# Altium schematic sheet Block scheme.SchDoc
size A4; Organization: My Company; Address1: Address Line 1; Address2: Address Line 2; Address3: Address Line 3; Address4: Address Line 4; SheetNumber: 1; SheetTotal: 8
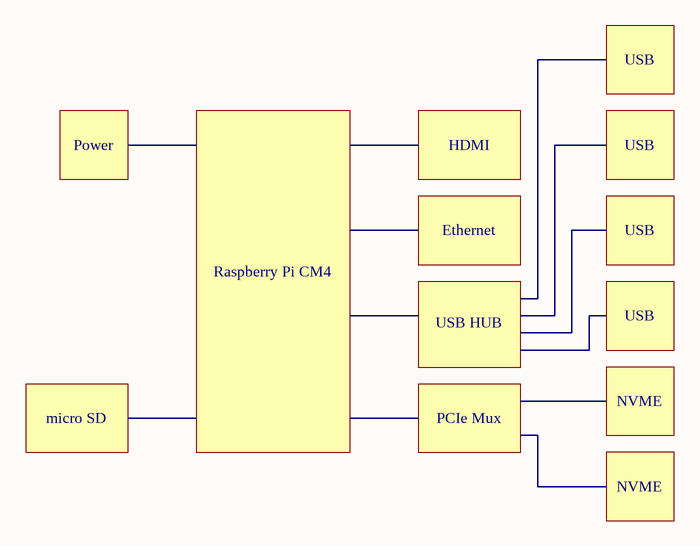
[diagram p0: Block scheme.SchDoc]

## Notes on the sheet
- USB
- Power
- HDMI
- Ethernet
- Raspberry Pi CM4
- USB HUB
- NVME
- micro SD
- PCIe Mux
- Title:
- Author:
- Approved:
- Size:
- Date:
- Git Hash:
- A4
- Prj:
- SW Version:
- Variant:
- Edited:
- CONFIDENTIAL
- File: